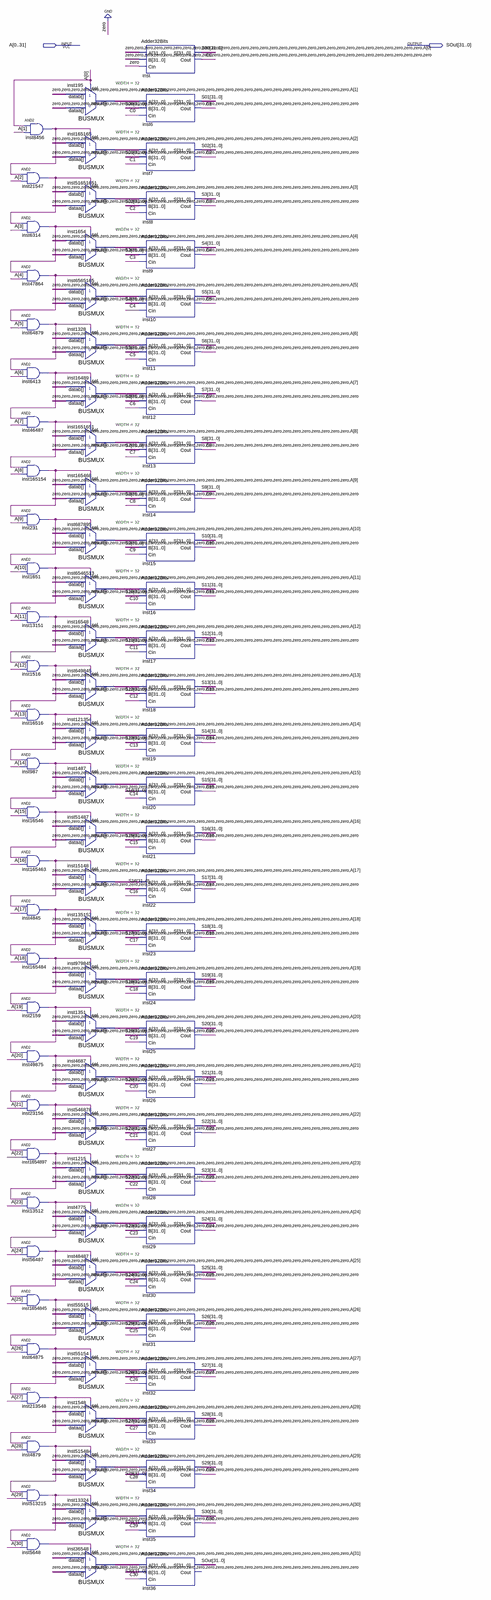
[diagram p0: schematic sheet, whole]
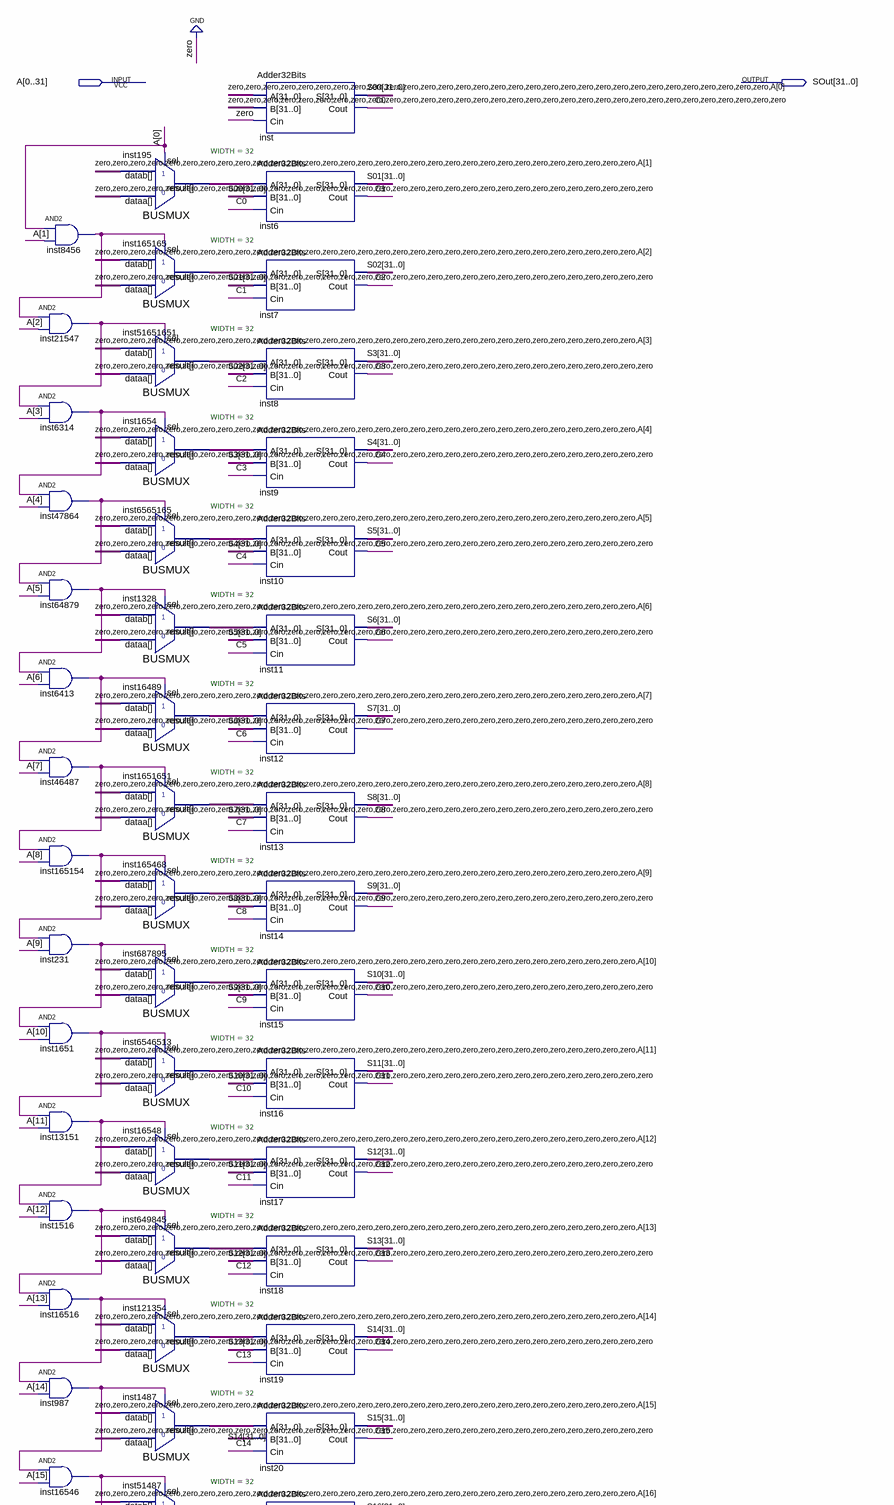
[diagram p1: schematic sheet, upper part]
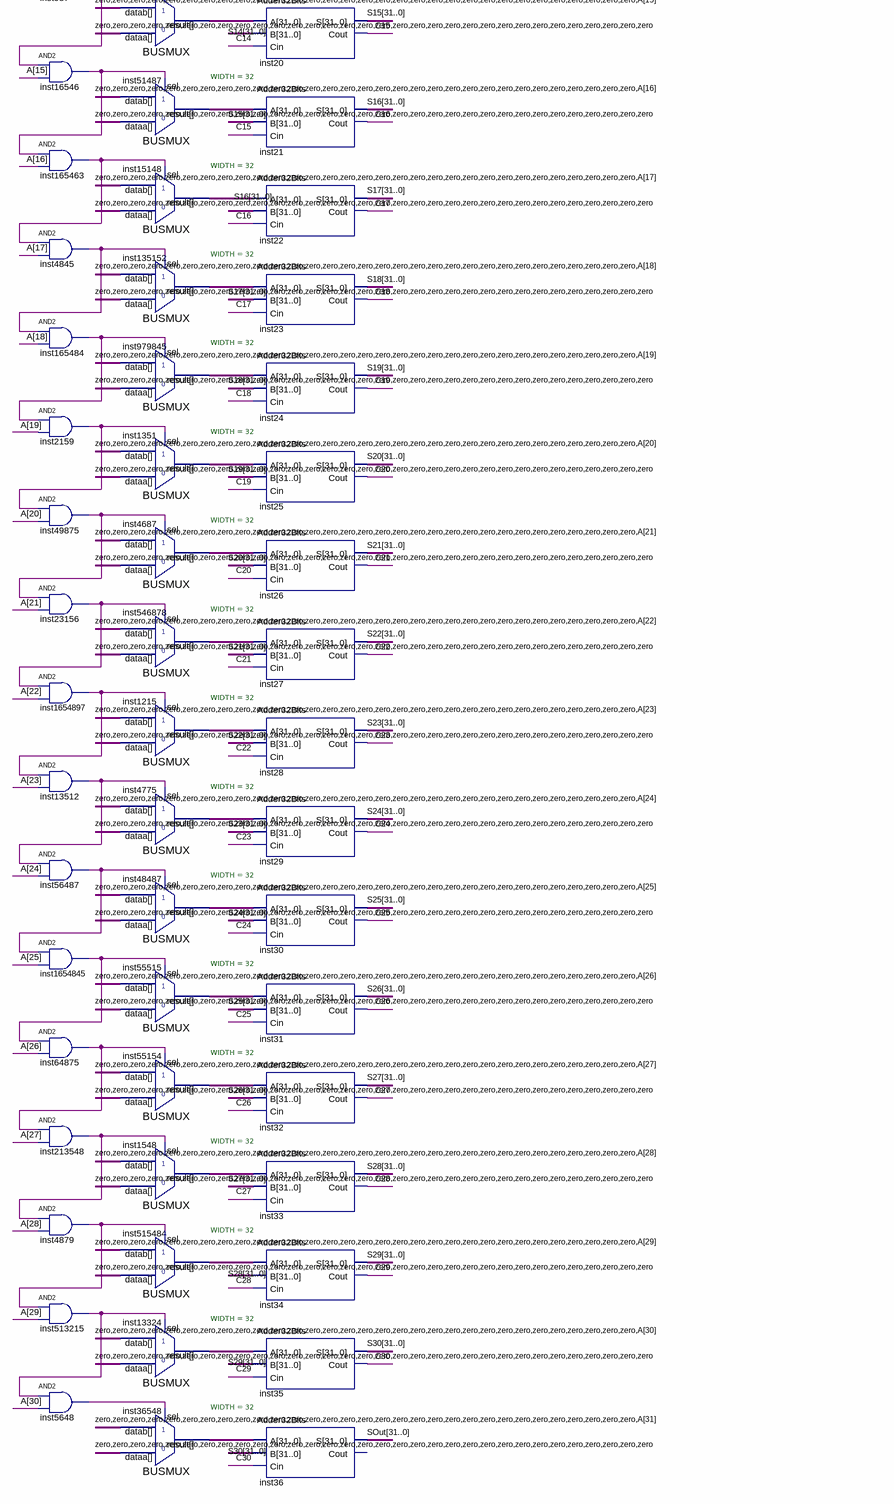
[diagram p2: schematic sheet, lower part]
// Quartus schematic CLO.bdf as structural Verilog: 93 symbols, 2 pins
module CLO (
  input  [0:31] A,
  output [31:0] SOut
);

  wire C0, C1, C2, C3, C4, C5, C6, C7, C8, C9, C10, C11, C12, C13, C14, C15, C16, C17, C18, C19, C20, C21,
       C22, C23, C24, C25, C26, C27, C28, C29, C30, inst231_out, inst987_out, inst1516_out, inst1651_out,
       inst2159_out, inst4845_out, inst4879_out, inst5648_out, inst6314_out, inst6413_out, inst8456_out,
       inst13151_out, inst13512_out, inst16516_out, inst16546_out, inst21547_out, inst23156_out,
       inst46487_out, inst47864_out, inst49875_out, inst56487_out, inst64875_out, inst64879_out,
       inst165154_out, inst165463_out, inst165484_out, inst213548_out, inst513215_out, inst1654845_out,
       inst1654897_out;
  wire [31:0] inst195_result, inst1215_result, inst1328_result, inst1351_result, inst1487_result,
       inst1548_result, inst1654_result, inst4687_result, inst4775_result, inst13324_result,
       inst15148_result, inst16489_result, inst16548_result, inst36548_result, inst48487_result,
       inst51487_result, inst55154_result, inst55515_result, inst121354_result, inst135152_result,
       inst165165_result, inst165468_result, inst515484_result, inst546878_result, inst649845_result,
       inst687895_result, inst979845_result, inst1651651_result, inst6546513_result, inst6565165_result,
       inst51651651_result, S00, S01, S02, S3, S4, S5, S6, S7, S8, S9, S10, S11, S12, S13, S14, S15, S16,
       S17, S18, S19, S20, S21, S22, S23, S24, S25, S26, S27, S28, S29, S30;

  and inst8456 (inst8456_out, A[0], A[1]);
  and inst21547 (inst21547_out, inst8456_out, A[2]);
  and inst6314 (inst6314_out, inst21547_out, A[3]);
  and inst47864 (inst47864_out, inst6314_out, A[4]);
  and inst64879 (inst64879_out, inst47864_out, A[5]);
  and inst6413 (inst6413_out, inst64879_out, A[6]);
  and inst46487 (inst46487_out, inst6413_out, A[7]);
  and inst165154 (inst165154_out, inst46487_out, A[8]);
  and inst231 (inst231_out, inst165154_out, A[9]);
  and inst1651 (inst1651_out, inst231_out, A[10]);
  and inst13151 (inst13151_out, inst1651_out, A[11]);
  and inst1516 (inst1516_out, inst13151_out, A[12]);
  and inst16516 (inst16516_out, inst1516_out, A[13]);
  and inst987 (inst987_out, inst16516_out, A[14]);
  and inst16546 (inst16546_out, inst987_out, A[15]);
  and inst165463 (inst165463_out, inst16546_out, A[16]);
  and inst4845 (inst4845_out, inst165463_out, A[17]);
  and inst165484 (inst165484_out, inst4845_out, A[18]);
  and inst2159 (inst2159_out, inst165484_out, A[19]);
  and inst49875 (inst49875_out, inst2159_out, A[20]);
  and inst23156 (inst23156_out, inst49875_out, A[21]);
  and inst1654897 (inst1654897_out, inst23156_out, A[22]);
  and inst13512 (inst13512_out, inst1654897_out, A[23]);
  and inst56487 (inst56487_out, inst13512_out, A[24]);
  and inst1654845 (inst1654845_out, inst56487_out, A[25]);
  and inst64875 (inst64875_out, inst1654845_out, A[26]);
  and inst213548 (inst213548_out, inst64875_out, A[27]);
  and inst4879 (inst4879_out, inst213548_out, A[28]);
  and inst513215 (inst513215_out, inst4879_out, A[29]);
  and inst5648 (inst5648_out, inst513215_out, A[30]);
  BUSMUX #(.WIDTH(32)) inst195 (.datab({{31{1'b0}}, A[1]}), .sel(A[0]), .dataa({32{1'b0}}), .result(inst195_result));
  BUSMUX #(.WIDTH(32)) inst165165 (
    .datab({{31{1'b0}}, A[2]}), .sel(inst8456_out), .dataa({32{1'b0}}), .result(inst165165_result));
  BUSMUX #(.WIDTH(32)) inst51651651 (
    .datab({{31{1'b0}}, A[3]}), .sel(inst21547_out), .dataa({32{1'b0}}), .result(inst51651651_result));
  BUSMUX #(.WIDTH(32)) inst1654 (
    .datab({{31{1'b0}}, A[4]}), .sel(inst6314_out), .dataa({32{1'b0}}), .result(inst1654_result));
  BUSMUX #(.WIDTH(32)) inst6565165 (
    .datab({{31{1'b0}}, A[5]}), .sel(inst47864_out), .dataa({32{1'b0}}), .result(inst6565165_result));
  BUSMUX #(.WIDTH(32)) inst1328 (
    .datab({{31{1'b0}}, A[6]}), .sel(inst64879_out), .dataa({32{1'b0}}), .result(inst1328_result));
  BUSMUX #(.WIDTH(32)) inst16489 (
    .datab({{31{1'b0}}, A[7]}), .sel(inst6413_out), .dataa({32{1'b0}}), .result(inst16489_result));
  BUSMUX #(.WIDTH(32)) inst1651651 (
    .datab({{31{1'b0}}, A[8]}), .sel(inst46487_out), .dataa({32{1'b0}}), .result(inst1651651_result));
  BUSMUX #(.WIDTH(32)) inst165468 (
    .datab({{31{1'b0}}, A[9]}), .sel(inst165154_out), .dataa({32{1'b0}}), .result(inst165468_result));
  BUSMUX #(.WIDTH(32)) inst687895 (
    .datab({{31{1'b0}}, A[10]}), .sel(inst231_out), .dataa({32{1'b0}}), .result(inst687895_result));
  BUSMUX #(.WIDTH(32)) inst6546513 (
    .datab({{31{1'b0}}, A[11]}), .sel(inst1651_out), .dataa({32{1'b0}}), .result(inst6546513_result));
  BUSMUX #(.WIDTH(32)) inst16548 (
    .datab({{31{1'b0}}, A[12]}), .sel(inst13151_out), .dataa({32{1'b0}}), .result(inst16548_result));
  BUSMUX #(.WIDTH(32)) inst649845 (
    .datab({{31{1'b0}}, A[13]}), .sel(inst1516_out), .dataa({32{1'b0}}), .result(inst649845_result));
  BUSMUX #(.WIDTH(32)) inst121354 (
    .datab({{31{1'b0}}, A[14]}), .sel(inst16516_out), .dataa({32{1'b0}}), .result(inst121354_result));
  BUSMUX #(.WIDTH(32)) inst1487 (
    .datab({{31{1'b0}}, A[15]}), .sel(inst987_out), .dataa({32{1'b0}}), .result(inst1487_result));
  BUSMUX #(.WIDTH(32)) inst51487 (
    .datab({{31{1'b0}}, A[16]}), .sel(inst16546_out), .dataa({32{1'b0}}), .result(inst51487_result));
  BUSMUX #(.WIDTH(32)) inst15148 (
    .datab({{31{1'b0}}, A[17]}), .sel(inst165463_out), .dataa({32{1'b0}}), .result(inst15148_result));
  BUSMUX #(.WIDTH(32)) inst135152 (
    .datab({{31{1'b0}}, A[18]}), .sel(inst4845_out), .dataa({32{1'b0}}), .result(inst135152_result));
  BUSMUX #(.WIDTH(32)) inst979845 (
    .datab({{31{1'b0}}, A[19]}), .sel(inst165484_out), .dataa({32{1'b0}}), .result(inst979845_result));
  BUSMUX #(.WIDTH(32)) inst1351 (
    .datab({{31{1'b0}}, A[20]}), .sel(inst2159_out), .dataa({32{1'b0}}), .result(inst1351_result));
  BUSMUX #(.WIDTH(32)) inst4687 (
    .datab({{31{1'b0}}, A[21]}), .sel(inst49875_out), .dataa({32{1'b0}}), .result(inst4687_result));
  BUSMUX #(.WIDTH(32)) inst546878 (
    .datab({{31{1'b0}}, A[22]}), .sel(inst23156_out), .dataa({32{1'b0}}), .result(inst546878_result));
  BUSMUX #(.WIDTH(32)) inst1215 (
    .datab({{31{1'b0}}, A[23]}), .sel(inst1654897_out), .dataa({32{1'b0}}), .result(inst1215_result));
  BUSMUX #(.WIDTH(32)) inst4775 (
    .datab({{31{1'b0}}, A[24]}), .sel(inst13512_out), .dataa({32{1'b0}}), .result(inst4775_result));
  BUSMUX #(.WIDTH(32)) inst48487 (
    .datab({{31{1'b0}}, A[25]}), .sel(inst56487_out), .dataa({32{1'b0}}), .result(inst48487_result));
  BUSMUX #(.WIDTH(32)) inst55515 (
    .datab({{31{1'b0}}, A[26]}), .sel(inst1654845_out), .dataa({32{1'b0}}), .result(inst55515_result));
  BUSMUX #(.WIDTH(32)) inst55154 (
    .datab({{31{1'b0}}, A[27]}), .sel(inst64875_out), .dataa({32{1'b0}}), .result(inst55154_result));
  BUSMUX #(.WIDTH(32)) inst1548 (
    .datab({{31{1'b0}}, A[28]}), .sel(inst213548_out), .dataa({32{1'b0}}), .result(inst1548_result));
  BUSMUX #(.WIDTH(32)) inst515484 (
    .datab({{31{1'b0}}, A[29]}), .sel(inst4879_out), .dataa({32{1'b0}}), .result(inst515484_result));
  BUSMUX #(.WIDTH(32)) inst13324 (
    .datab({{31{1'b0}}, A[30]}), .sel(inst513215_out), .dataa({32{1'b0}}), .result(inst13324_result));
  BUSMUX #(.WIDTH(32)) inst36548 (
    .datab({{31{1'b0}}, A[31]}), .sel(inst5648_out), .dataa({32{1'b0}}), .result(inst36548_result));
  Adder32Bits inst (.A({{31{1'b0}}, A[0]}), .B({32{1'b0}}), .Cin(1'b0), .S(S00), .Cout(C0));
  Adder32Bits inst6 (.A(inst195_result), .B(S00), .Cin(C0), .S(S01), .Cout(C1));
  Adder32Bits inst7 (.A(inst165165_result), .B(S01), .Cin(C1), .S(S02), .Cout(C2));
  Adder32Bits inst8 (.A(inst51651651_result), .B(S02), .Cin(C2), .S(S3), .Cout(C3));
  Adder32Bits inst9 (.A(inst1654_result), .B(S3), .Cin(C3), .S(S4), .Cout(C4));
  Adder32Bits inst10 (.A(inst6565165_result), .B(S4), .Cin(C4), .S(S5), .Cout(C5));
  Adder32Bits inst11 (.A(inst1328_result), .B(S5), .Cin(C5), .S(S6), .Cout(C6));
  Adder32Bits inst12 (.A(inst16489_result), .B(S6), .Cin(C6), .S(S7), .Cout(C7));
  Adder32Bits inst13 (.A(inst1651651_result), .B(S7), .Cin(C7), .S(S8), .Cout(C8));
  Adder32Bits inst14 (.A(inst165468_result), .B(S8), .Cin(C8), .S(S9), .Cout(C9));
  Adder32Bits inst15 (.A(inst687895_result), .B(S9), .Cin(C9), .S(S10), .Cout(C10));
  Adder32Bits inst16 (.A(inst6546513_result), .B(S10), .Cin(C10), .S(S11), .Cout(C11));
  Adder32Bits inst17 (.A(inst16548_result), .B(S11), .Cin(C11), .S(S12), .Cout(C12));
  Adder32Bits inst18 (.A(inst649845_result), .B(S12), .Cin(C12), .S(S13), .Cout(C13));
  Adder32Bits inst19 (.A(inst121354_result), .B(S13), .Cin(C13), .S(S14), .Cout(C14));
  Adder32Bits inst20 (.A(inst1487_result), .B(S14), .Cin(C14), .S(S15), .Cout(C15));
  Adder32Bits inst21 (.A(inst51487_result), .B(S15), .Cin(C15), .S(S16), .Cout(C16));
  Adder32Bits inst22 (.A(inst15148_result), .B(S16), .Cin(C16), .S(S17), .Cout(C17));
  Adder32Bits inst23 (.A(inst135152_result), .B(S17), .Cin(C17), .S(S18), .Cout(C18));
  Adder32Bits inst24 (.A(inst979845_result), .B(S18), .Cin(C18), .S(S19), .Cout(C19));
  Adder32Bits inst25 (.A(inst1351_result), .B(S19), .Cin(C19), .S(S20), .Cout(C20));
  Adder32Bits inst26 (.A(inst4687_result), .B(S20), .Cin(C20), .S(S21), .Cout(C21));
  Adder32Bits inst27 (.A(inst546878_result), .B(S21), .Cin(C21), .S(S22), .Cout(C22));
  Adder32Bits inst28 (.A(inst1215_result), .B(S22), .Cin(C22), .S(S23), .Cout(C23));
  Adder32Bits inst29 (.A(inst4775_result), .B(S23), .Cin(C23), .S(S24), .Cout(C24));
  Adder32Bits inst30 (.A(inst48487_result), .B(S24), .Cin(C24), .S(S25), .Cout(C25));
  Adder32Bits inst31 (.A(inst55515_result), .B(S25), .Cin(C25), .S(S26), .Cout(C26));
  Adder32Bits inst32 (.A(inst55154_result), .B(S26), .Cin(C26), .S(S27), .Cout(C27));
  Adder32Bits inst33 (.A(inst1548_result), .B(S27), .Cin(C27), .S(S28), .Cout(C28));
  Adder32Bits inst34 (.A(inst515484_result), .B(S28), .Cin(C28), .S(S29), .Cout(C29));
  Adder32Bits inst35 (.A(inst13324_result), .B(S29), .Cin(C29), .S(S30), .Cout(C30));
  Adder32Bits inst36 (.A(inst36548_result), .B(S30), .Cin(C30), .S(SOut));  // open: Cout
endmodule
